# EasyEDA Pro project uven2-mk3-cc-driver-25x.eprj, schematic AL8843-cc-driver
Board Name: AL8843-cc-driver; Create Date: 2025-07-06; Page Name: P1; Project Name: uven2-mk3-cc-driver-25x; Schematic Name: AL8843-cc-driver; Update Date: 2025-07-06; Company: EasyEDA.com; Page Size: A4; Version: V1.0
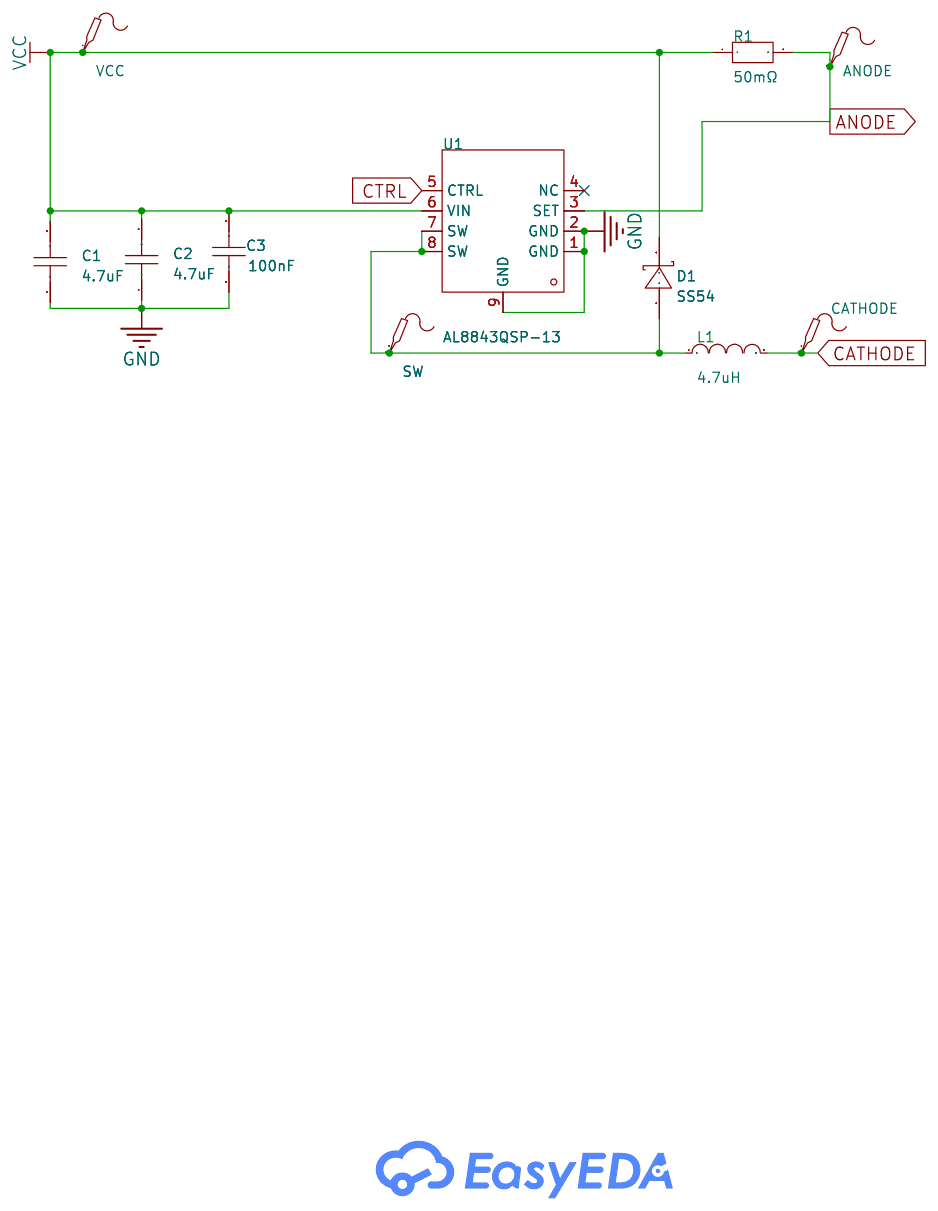
[diagram p1: schematic sheet]

## Parts
ANODE  -  [Test-Point-0.5mm]
C1  4.7uF  [C1210]
C2  4.7uF  [C1210]
C3  100nF  [C0603]
CATHODE  -  [Test-Point-0.5mm]
D1  SS54  [SMA_L4.4-W2.8-LS5.4-R-RD]
L1  4.7uH  [IND-SMD_L10.2-W10.0_MS104R]
R1  50mΩ  [R1206]
SW  -  [Test-Point-0.5mm]
U1  AL8843QSP-13  [SOIC-8_L4.9-W3.9-P1.27-LS6.0-BL-EP3.1-1]
VCC  -  [Test-Point-0.5mm]

## Library data of the parts
ANODE CATHODE SW VCC = Test-Point: Test Point 测试点
C1 C2 = CL32B475KBUYNNE: Capacitance: Tolerance:±10% Tolerance:±10% Voltage Rated: Temperature Coefficient:; LCSC Part Name: 4.7uF ±10% 50V; Supplier Part: C170099; Manufacturer: SAMSUNG(三星); Supplier Footprint: 1210; JLCPCB Part Class: Extended Part; Datasheet: https://atta.szlcsc.com/upload/public/pdf/source/20191106/C444885_D1DE823F0ED498E02883F0194C396E9C.pdf; Supplier: LCSC; Tolerance: ±10%
C3 = GCM188R91E104KA37J: Capacitance:100nF Tolerance:±10% Tolerance:±10% Voltage Rating:25V Temperature Coefficient:X8R; LCSC Part Name: 100nF ±10% 25V; Supplier Part: C1864419; Manufacturer: muRata(村田); Supplier Footprint: 0603; JLCPCB Part Class: Extended Part; Datasheet: https://atta.szlcsc.com/upload/public/pdf/source/20210427/996B949F2BD832325BEACB68822ED730.pdf; Supplier: LCSC; Tolerance: ±10%; Voltage Rating: 25V; Temperature Coefficient: X8R
D1 = SS54_C22452: Diode Configuration:Independent Type Forward Voltage (Vf@If):550mV@5A Reverse Voltage (Vr):40V Rectified Current:5A Reverse Leakage Current (Ir):1mA@40V; LCSC Part Name: 电压:40V 电流:5A; Supplier Part: C22452; Manufacturer: MDD(辰达半导体); Supplier Footprint: SMA(DO-214AC); JLCPCB Part Class: Basic Part; Datasheet: https://atta.szlcsc.com/upload/public/pdf/source/20240710/73DFBB65C1883B895E62D589679033DF.pdf; Supplier: LCSC; Diode Configuration: Independent Type; Forward Voltage (Vf@If): 550mV@5A; Reverse Voltage (Vr): 40V; Rectified Current: 5A; Reverse Leakage Current (Ir): 1mA@40V
L1 = CDRH103RNP-4R7NC-B: Inductance: Tolerance:±30% Tolerance:±30% Rated Current: Saturation Current (Isat):4.65A DC Resistance (DCR):; LCSC Part Name: 4.7uH ±30% 4.65A; Supplier Part: C338773; Manufacturer: Sumida(胜美达); Supplier Footprint: SMD,10.2x10mm; JLCPCB Part Class: Extended Part; Datasheet: https://atta.szlcsc.com/upload/public/pdf/source/20181128/C338773_52CA1E1860B6648B1F1F8CE1B356C961.pdf; Supplier: LCSC; Tolerance: ±30%; Saturation Current (Isat): 4.65A
R1 = RLM12FTCMR050: Type:Current Sensing Resistors Resistance:50mΩ Tolerance:±1% Tolerance:±1% Rated Output Voltage:- Power(Watts): Rated Current:- Mounting Sytle:Surface Mount; LCSC Part Name: 50mΩ ±1% 1W; Supplier Part: C912768; Manufacturer: 大毅科技; Supplier Footprint: 1206; JLCPCB Part Class: Extended Part; Datasheet: https://atta.szlcsc.com/upload/public/pdf/source/20190625/C393094_1D12BC44783F266A3BFDD0B943BC1FBD.pdf; Supplier: LCSC; Type: Current Sensing Resistors; Tolerance: ±1%; Mounting Sytle: Surface Mount
U1 = AL8843QSP-13: Type:DC-DCVoltage Stabilizer Voltage - Input:4.5V~40V Voltage - Input:4.5V~40V Frequency - Switching:1MHz Frequency - Switching:1MHz Number of Channels:1 Output Current:3A Dimming:Analog；PWM Topology:Step-down Operating temperature:-40℃~+125℃ Operating te; Supplier Part: C510553; Manufacturer: DIODES(美台); Supplier Footprint: SOIC-8-EP; JLCPCB Part Class: Extended Part; Datasheet: https://atta.szlcsc.com/upload/public/pdf/source/20200407/C510553_07146F09094C825C2BAA3A96B7FE9A33.pdf; Supplier: LCSC; Type: DC-DCVoltage Stabilizer; Voltage - Input: 4.5V~40V; Frequency - Switching: 1MHz; Number of Channels: 1; Output Current: 3A; Dimming: Analog；PWM; Topology: Step-down; Operating temperature: -40℃~+125℃

## Nets
GND: C1.1 C2.1 C3.1 U1.1(GND) U1.2(GND) U1.9(GND)
VCC: C1.2 C2.2 C3.2 D1.2(K) R1.1 U1.6(VIN) VCC.1
ANODE: ANODE.1 R1.2 U1.3(SET)
CATHODE: CATHODE.1 L1.2
CTRL: U1.5(CTRL)
$1N360: D1.1(A) L1.1 SW.1 U1.7(SW) U1.8(SW)

Not connected (* = marked no-connect by the designer): U1 4(NC)*
